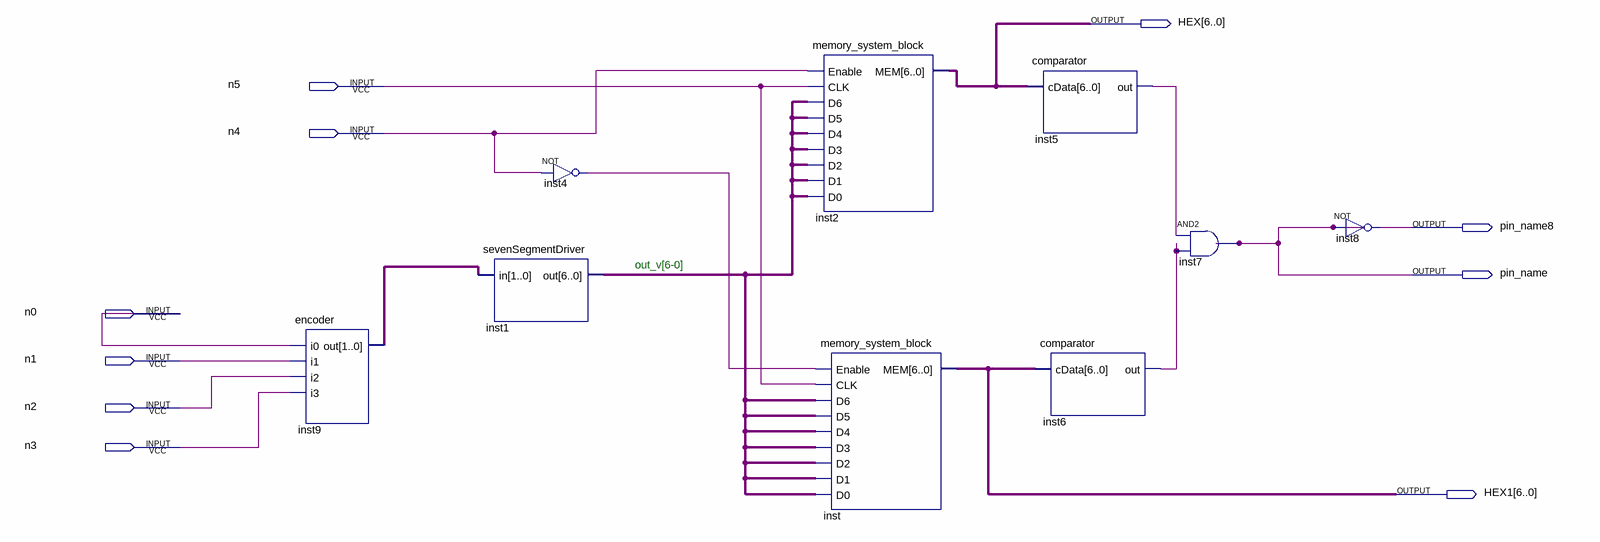
[diagram p0: schematic sheet]
// Quartus schematic Block2.bdf as structural Verilog: 9 symbols, 10 pins
module Block2 (
  input  n5,
  input  n4,
  input  n0,
  input  n1,
  input  n2,
  input  n3,
  output [6:0] HEX,
  output pin_name8,
  output pin_name,
  output [6:0] HEX1
);

  wire inst4_out, inst5_out, inst6_out;
  wire [1:0] inst9_out;
  wire [6:0] inst1_out;

  encoder inst9 (.i0(n0), .i1(n1), .i2(n2), .i3(n3), .out(inst9_out));
  sevenSegmentDriver inst1 (.in(inst9_out), .out(inst1_out));
  not inst4 (inst4_out, n4);
  memory_system_block inst2 (
    .Enable(n4), .CLK(n5), .D6(inst1_out), .D5(inst1_out), .D4(inst1_out), .D3(inst1_out), .D2(inst1_out),
    .D1(inst1_out), .D0(inst1_out), .MEM(HEX));
  memory_system_block inst (
    .Enable(inst4_out), .CLK(n5), .D6(inst1_out), .D5(inst1_out), .D4(inst1_out), .D3(inst1_out),
    .D2(inst1_out), .D1(inst1_out), .D0(inst1_out), .MEM(HEX1));
  comparator inst5 (.cData(HEX), .out(inst5_out));
  comparator inst6 (.cData(HEX1), .out(inst6_out));
  and inst7 (pin_name, inst5_out, inst6_out);
  not inst8 (pin_name8, pin_name);

  // Notes on the sheet:
  //   out_v[6-0]
endmodule
